# EAGLE design RPi_Extension_contr_sens_conn_board (EAGLE 8.1.1)
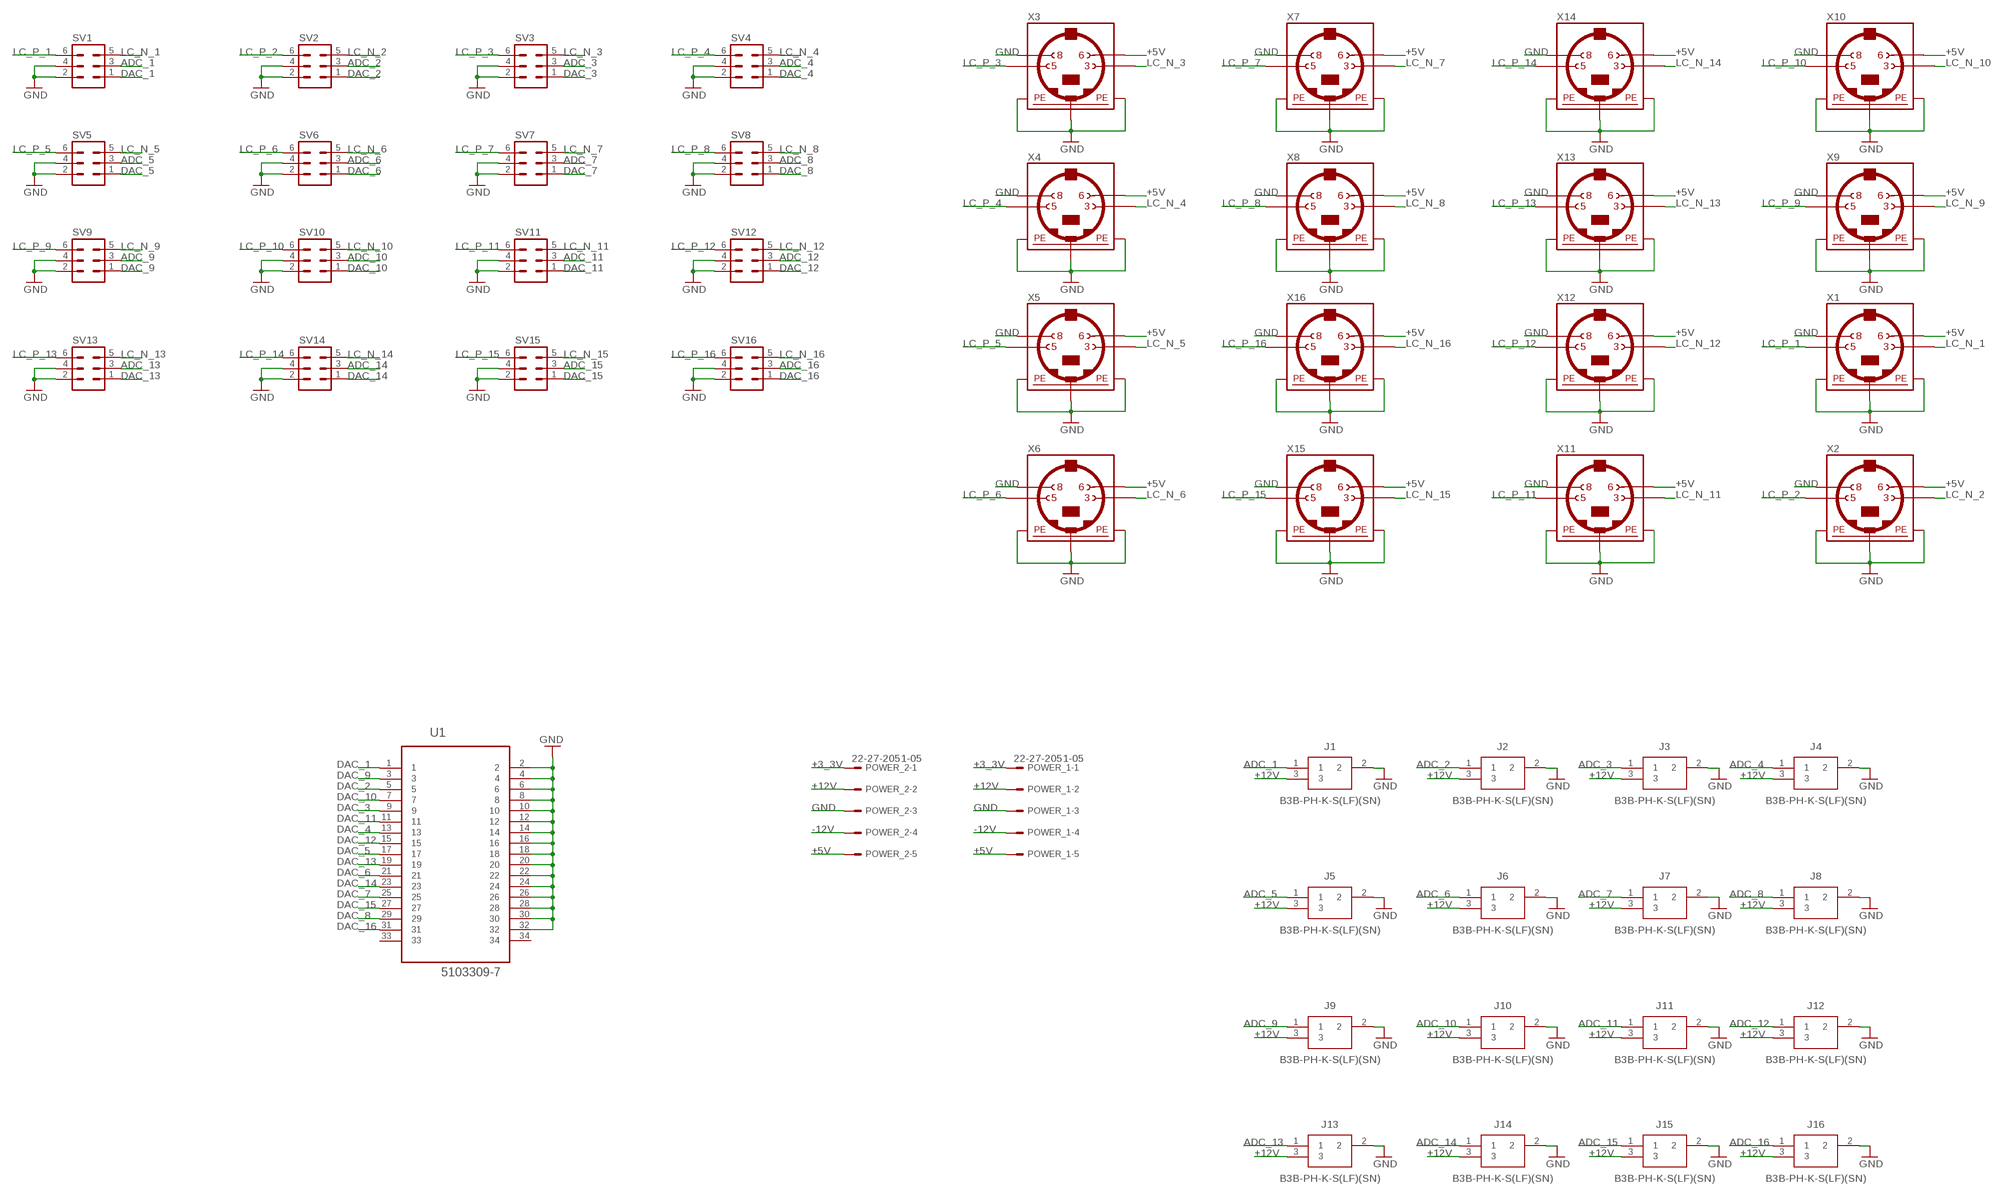
[diagram p0: schematic, sheet 1]

## Parts
J1  B3B-PH-K-S(LF)(SN)  [SHDR3W50P0X200_1X3_790X450X600]
J2  B3B-PH-K-S(LF)(SN)  [SHDR3W50P0X200_1X3_790X450X600]
J3  B3B-PH-K-S(LF)(SN)  [SHDR3W50P0X200_1X3_790X450X600]
J4  B3B-PH-K-S(LF)(SN)  [SHDR3W50P0X200_1X3_790X450X600]
J5  B3B-PH-K-S(LF)(SN)  [SHDR3W50P0X200_1X3_790X450X600]
J6  B3B-PH-K-S(LF)(SN)  [SHDR3W50P0X200_1X3_790X450X600]
J7  B3B-PH-K-S(LF)(SN)  [SHDR3W50P0X200_1X3_790X450X600]
J8  B3B-PH-K-S(LF)(SN)  [SHDR3W50P0X200_1X3_790X450X600]
J9  B3B-PH-K-S(LF)(SN)  [SHDR3W50P0X200_1X3_790X450X600]
J10  B3B-PH-K-S(LF)(SN)  [SHDR3W50P0X200_1X3_790X450X600]
J11  B3B-PH-K-S(LF)(SN)  [SHDR3W50P0X200_1X3_790X450X600]
J12  B3B-PH-K-S(LF)(SN)  [SHDR3W50P0X200_1X3_790X450X600]
J13  B3B-PH-K-S(LF)(SN)  [SHDR3W50P0X200_1X3_790X450X600]
J14  B3B-PH-K-S(LF)(SN)  [SHDR3W50P0X200_1X3_790X450X600]
J15  B3B-PH-K-S(LF)(SN)  [SHDR3W50P0X200_1X3_790X450X600]
J16  B3B-PH-K-S(LF)(SN)  [SHDR3W50P0X200_1X3_790X450X600]
POWER_1  22-27-2051-05  [6410-05]
POWER_2  22-27-2051-05  [6410-05]
SV1  MA03-2  [MA03-2]
SV2  MA03-2  [MA03-2]
SV3  MA03-2  [MA03-2]
SV4  MA03-2  [MA03-2]
SV5  MA03-2  [MA03-2]
SV6  MA03-2  [MA03-2]
SV7  MA03-2  [MA03-2]
SV8  MA03-2  [MA03-2]
SV9  MA03-2  [MA03-2]
SV10  MA03-2  [MA03-2]
SV11  MA03-2  [MA03-2]
SV12  MA03-2  [MA03-2]
SV13  MA03-2  [MA03-2]
SV14  MA03-2  [MA03-2]
SV15  MA03-2  [MA03-2]
SV16  MA03-2  [MA03-2]
U1  5103309-7  [TYCO_5103309-7]
X1  MINI_DIN_4  [M_DIN4]
X2  MINI_DIN_4  [M_DIN4]
X3  MINI_DIN_4  [M_DIN4]
X4  MINI_DIN_4  [M_DIN4]
X5  MINI_DIN_4  [M_DIN4]
X6  MINI_DIN_4  [M_DIN4]
X7  MINI_DIN_4  [M_DIN4]
X8  MINI_DIN_4  [M_DIN4]
X9  MINI_DIN_4  [M_DIN4]
X10  MINI_DIN_4  [M_DIN4]
X11  MINI_DIN_4  [M_DIN4]
X12  MINI_DIN_4  [M_DIN4]
X13  MINI_DIN_4  [M_DIN4]
X14  MINI_DIN_4  [M_DIN4]
X15  MINI_DIN_4  [M_DIN4]
X16  MINI_DIN_4  [M_DIN4]

## Nets
+3_3V: POWER_1.1 POWER_2.1
+5V: POWER_1.5 POWER_2.5 X1.6 X2.6 X3.6 X4.6 X5.6 X6.6 X7.6 X8.6 X9.6 X10.6 X11.6 X12.6 X13.6 X14.6 X15.6 X16.6
+12V: J1.3 J2.3 J3.3 J4.3 J5.3 J6.3 J7.3 J8.3 J9.3 J10.3 J11.3 J12.3 J13.3 J14.3 J15.3 J16.3 POWER_1.2 POWER_2.2
-12V: POWER_1.4 POWER_2.4
ADC_1: J1.1 SV1.3
ADC_2: J2.1 SV2.3
ADC_3: J3.1 SV3.3
ADC_4: J4.1 SV4.3
ADC_5: J5.1 SV5.3
ADC_6: J6.1 SV6.3
ADC_7: J7.1 SV7.3
ADC_8: J8.1 SV8.3
ADC_9: J9.1 SV9.3
ADC_10: J10.1 SV10.3
ADC_11: J11.1 SV11.3
ADC_12: J12.1 SV12.3
ADC_13: J13.1 SV13.3
ADC_14: J14.1 SV14.3
ADC_15: J15.1 SV15.3
ADC_16: J16.1 SV16.3
DAC_1: SV1.1 U1.1
DAC_2: SV2.1 U1.5
DAC_3: SV3.1 U1.9
DAC_4: SV4.1 U1.13
DAC_5: SV5.1 U1.17
DAC_6: SV6.1 U1.21
DAC_7: SV7.1 U1.25
DAC_8: SV8.1 U1.29
DAC_9: SV9.1 U1.3
DAC_10: SV10.1 U1.7
DAC_11: SV11.1 U1.11
DAC_12: SV12.1 U1.15
DAC_13: SV13.1 U1.19
DAC_14: SV14.1 U1.23
DAC_15: SV15.1 U1.27
DAC_16: SV16.1 U1.31
GND: J1.2 J2.2 J3.2 J4.2 J5.2 J6.2 J7.2 J8.2 J9.2 J10.2 J11.2 J12.2 J13.2 J14.2 J15.2 J16.2 POWER_1.3 POWER_2.3 SV1.2 SV1.4 SV2.2 SV2.4 SV3.2 SV3.4 SV4.2 SV4.4 SV5.2 SV5.4 SV6.2 SV6.4 SV7.2 SV7.4 SV8.2 SV8.4 SV9.2 SV9.4 SV10.2 SV10.4 SV11.2 SV11.4 SV12.2 SV12.4 SV13.2 SV13.4 SV14.2 SV14.4 SV15.2 SV15.4 SV16.2 SV16.4 U1.2 U1.4 U1.6 U1.8 U1.10 U1.12 U1.14 U1.16 U1.18 U1.20 U1.22 U1.24 U1.26 U1.28 U1.30 U1.32 X1.8 X1.SH1(PE1) X1.SH2(PE2) X1.SH3(PE3) X2.8 X2.SH1(PE1) X2.SH2(PE2) X2.SH3(PE3) X3.8 X3.SH1(PE1) X3.SH2(PE2) X3.SH3(PE3) X4.8 X4.SH1(PE1) X4.SH2(PE2) X4.SH3(PE3) X5.8 X5.SH1(PE1) X5.SH2(PE2) X5.SH3(PE3) X6.8 X6.SH1(PE1) X6.SH2(PE2) X6.SH3(PE3) X7.8 X7.SH1(PE1) X7.SH2(PE2) X7.SH3(PE3) X8.8 X8.SH1(PE1) X8.SH2(PE2) X8.SH3(PE3) X9.8 X9.SH1(PE1) X9.SH2(PE2) X9.SH3(PE3) X10.8 X10.SH1(PE1) X10.SH2(PE2) X10.SH3(PE3) X11.8 X11.SH1(PE1) X11.SH2(PE2) X11.SH3(PE3) X12.8 X12.SH1(PE1) X12.SH2(PE2) X12.SH3(PE3) X13.8 X13.SH1(PE1) X13.SH2(PE2) X13.SH3(PE3) X14.8 X14.SH1(PE1) X14.SH2(PE2) X14.SH3(PE3) X15.8 X15.SH1(PE1) X15.SH2(PE2) X15.SH3(PE3) X16.8 X16.SH1(PE1) X16.SH2(PE2) X16.SH3(PE3)
LC_N_1: SV1.5 X1.3
LC_N_2: SV2.5 X2.3
LC_N_3: SV3.5 X3.3
LC_N_4: SV4.5 X4.3
LC_N_5: SV5.5 X5.3
LC_N_6: SV6.5 X6.3
LC_N_7: SV7.5 X7.3
LC_N_8: SV8.5 X8.3
LC_N_9: SV9.5 X9.3
LC_N_10: SV10.5 X10.3
LC_N_11: SV11.5 X11.3
LC_N_12: SV12.5 X12.3
LC_N_13: SV13.5 X13.3
LC_N_14: SV14.5 X14.3
LC_N_15: SV15.5 X15.3
LC_N_16: SV16.5 X16.3
LC_P_1: SV1.6 X1.5
LC_P_2: SV2.6 X2.5
LC_P_3: SV3.6 X3.5
LC_P_4: SV4.6 X4.5
LC_P_5: SV5.6 X5.5
LC_P_6: SV6.6 X6.5
LC_P_7: SV7.6 X7.5
LC_P_8: SV8.6 X8.5
LC_P_9: SV9.6 X9.5
LC_P_10: SV10.6 X10.5
LC_P_11: SV11.6 X11.5
LC_P_12: SV12.6 X12.5
LC_P_13: SV13.6 X13.5
LC_P_14: SV14.6 X14.5
LC_P_15: SV15.6 X15.5
LC_P_16: SV16.6 X16.5
Unconnected: U1.33 U1.34

## Library data of the parts
J1-J16 = JST_PH:B3B-PH-K-S(LF)(SN): PH-2.0mm Header top entry 3 way JST PH Series, Series Number B3B, 2mm Pitch 3 Way 1 Row Straight PCB Header, Through Hole Termination, 2A <https://componentsearchengine.com/Images/3/B3B-PH-K-S%28LF%29%28SN%29.jpg> Source: Datasheet <http://uk.rs-online.com/web/p/products/8201431>; DESCRIPTION: PH-2.0mm Header top entry 3 way JST PH Series, Series Number B3B, 2mm Pitch 3 Way 1 Row Straight PCB Header, Through Hole Termination, 2A; HEIGHT: 6mm; MANUFACTURER_NAME: JST (JAPAN SOLDERLESS TERMINALS); MANUFACTURER_PART_NUMBER: B3B-PH-K-S(LF)(SN); RS_PART_NUMBER: 8201431P; SUPPLIER_NAME: RS
POWER_1 POWER_2 = con-molex:22-?-05: CONNECTOR wire to board 2.54 mm (.1 inch) pitch header; OC_FARNELL: unknown; OC_NEWARK: unknown
SV1-SV16 = con-lstb:MA03-2: PIN HEADER; OC_FARNELL: unknown; OC_NEWARK: unknown
U1 = AMP 5103309-7 34pin:5103309-7: WIRE-BOARD CONN, HEADER, 34POS; MPN: 5103309-7; OC_FARNELL: 1425170; OC_NEWARK: 02M6713; PACKAGE: 34 WAY HEADER; SUPPLIER: TycoElectronics
X1-X16 = mini_din:MINI_DIN_4

## Board
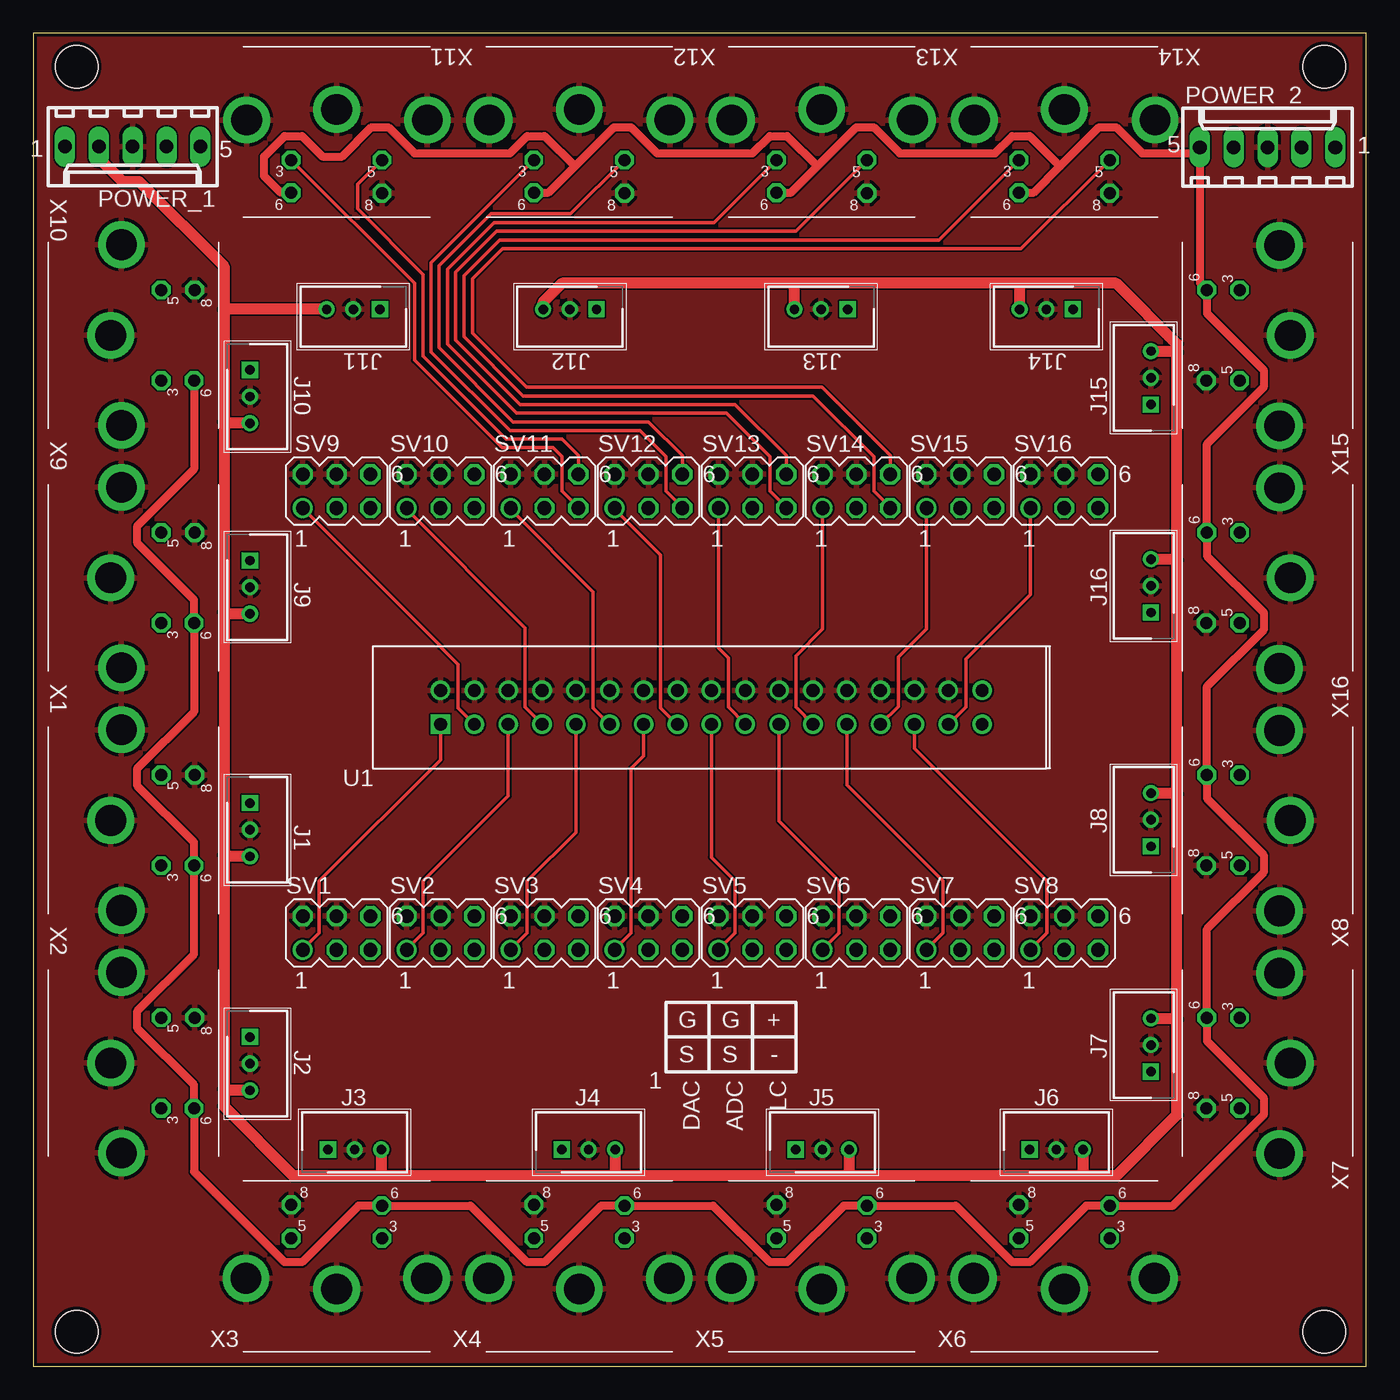
[diagram p1: board, top side]
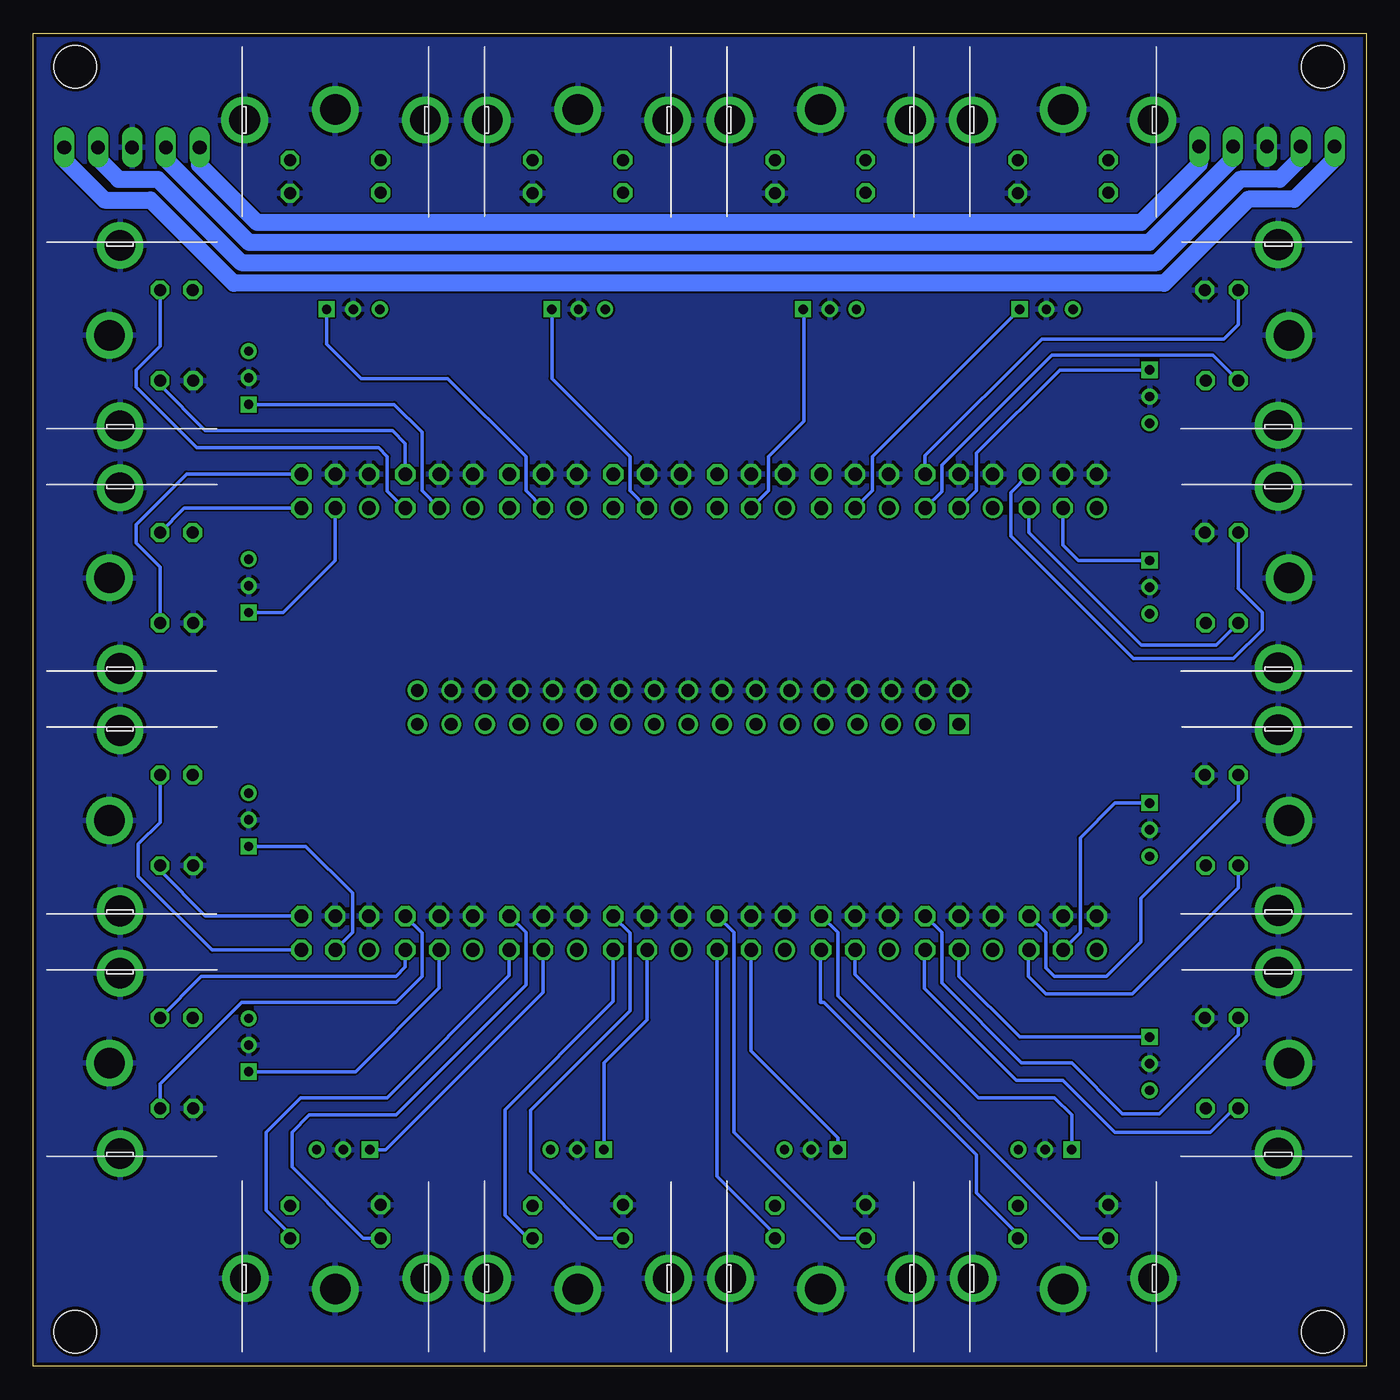
[diagram p2: board, bottom side, seen from below]

Size 100 x 100 mm. Coordinates in mm from the lower left corner, seen from the top.
Outline: 0,0 100,0 100,100 0,100 0,0
Copper layers (1*16): Top 0.035mm / dielectric 1.5mm / Bottom 0.035mm
Design rules "dirt_cheap_dirty_boards.v1": minimum track width 5mil, minimum drill 12mil, track to track 5mil, track to pad 5mil, pad to pad 5mil, via to via 5mil, smd to smd 0mil, copper to edge 10mil, drill to drill 10mil, minimum pad ring 10mil, minimum via ring 6mil, stop-mask expansion 2mil, vias tented up to drill 25mil, thermal gap 10mil
Holes 3.2 mm at 3.25,97.5 96.85,97.5 3.25,2.6 96.85,2.6

### Footprints (pad centres in the part's own frame; a part is rotated, then mirrored left to right if it is on the bottom)
SHDR3W50P0X200_1X3_790X450X600 = drill 0.7 pad 1.1 square: 1 0,0 | drill 0.7 pad 1.1: 2 2,0; 3 4,0
6410-05 = drill 1.016 long: 1 5.08,0; 2 2.54,0; 3 0,0; 4 -2.54,0; 5 -5.08,0
MA03-2 = drill 1.016: 1 -2.54,-1.27 | drill 1.016 octagon: 2 -2.54,1.27; 3 0,-1.27; 4 0,1.27; 5 2.54,-1.27; 6 2.54,1.27
TYCO_5103309-7 = drill 0.965 square: 1 0,2.54 | drill 0.965: 2 0,0; 3 -2.54,2.54; 4 -2.54,0; 5 -5.08,2.54; 6 -5.08,0; 7 -7.62,2.54; 8 -7.62,0; 9 -10.16,2.54; 10 -10.16,0; 11 -12.7,2.54; 12 -12.7,0; 13 -15.24,2.54; 14 -15.24,0; 15 -17.78,2.54; 16 -17.78,0; 17 -20.32,2.54; 18 -20.32,0; 19 -22.86,2.54; 20 -22.86,0; 21 -25.4,2.54; 22 -25.4,0; 23 -27.94,2.54; 24 -27.94,0; 25 -30.48,2.54; 26 -30.48,0; 27 -33.02,2.54; 28 -33.02,0; 29 -35.56,2.54; 30 -35.56,0; 31 -38.1,2.54; 32 -38.1,0; 33 -40.64,2.54; 34 -40.64,0
M_DIN4 = drill 0.9 pad 1.422 octagon: 3 -3.4,-3.75; 5 3.4,-3.75; 6 -3.4,-6.2; 8 3.4,-6.25 | drill 2.3 pad 3.5: SH1 6.8,-0.75; SH2 0,0.05; SH3 -6.75,-0.75

### Placement (x,y rotation side)
J1  16.25,42.25 270 top
J2  16.25,24.7 270 top
J3  22.1,16.25 0 top
J4  39.65,16.25 0 top
J5  57.2,16.25 0 top
J6  74.75,16.25 0 top
J7  83.85,22.1 90 top
J8  83.85,39 90 top
J9  16.25,60.45 270 top
J10  16.25,74.75 270 top
J11  26,79.3 180 top
J12  42.25,79.3 180 top
J13  61.1,79.3 180 top
J14  78,79.3 180 top
J15  83.85,72.15 90 top
J16  83.85,56.55 90 top
POWER_1  7.45,91.5 180 top
POWER_2  92.6,91.45 0 top
SV1  22.75,32.5 0 top
SV2  30.55,32.5 0 top
SV3  38.35,32.5 0 top
SV4  46.15,32.5 0 top
SV5  53.95,32.5 0 top
SV6  61.75,32.5 0 top
SV7  69.55,32.5 0 top
SV8  77.35,32.5 0 top
SV9  22.75,65.65 0 top
SV10  30.55,65.65 0 top
SV11  38.35,65.65 0 top
SV12  46.15,65.65 0 top
SV13  53.95,65.65 0 top
SV14  61.75,65.65 0 top
SV15  69.55,65.65 0 top
SV16  77.35,65.65 0 top
U1  30.55,50.7 180 top
X1  5.85,40.95 90 top
X2  5.85,22.75 90 top
X3  22.75,5.85 180 top
X4  40.95,5.85 180 top
X5  59.15,5.85 180 top
X6  77.35,5.85 180 top
X7  94.25,22.75 270 top
X8  94.25,40.95 270 top
X9  5.85,59.15 90 top
X10  5.85,77.35 90 top
X11  22.75,94.25 0 top
X12  40.95,94.25 0 top
X13  59.15,94.25 0 top
X14  77.35,94.25 0 top
X15  94.25,77.35 270 top
X16  94.25,59.15 270 top

### Tracks (layer width: path | path; a pad name or v marks a point on that pad's centre or on a via)
+3_3V
  Bottom 1.27: POWER_1.1 2.37,90.58 5.4,87.55 8.85,87.55 15.15,81.25 84.95,81.25 91.2,87.5 94.65,87.5 97.68,90.53 POWER_2.1
+5V
  Top 0.61: X10.6 12.05,67.3 7.8,63.05 7.8,61.75 12.05,57.5 X9.6 12.05,49.1 7.8,44.85 7.8,43.55 12.05,39.3 X1.6 12.05,30.9 7.8,26.65 7.8,25.35 12.05,21.1 X2.6 12.05,14.6 18.85,7.8 20.15,7.8 24.4,12.05 X3.6 32.8,12.05 37.05,7.8 38.35,7.8 42.6,12.05 X4.6 51,12.05 55.25,7.8 56.55,7.8 60.8,12.05 X5.6 69.2,12.05 73.45,7.8 74.75,7.8 79,12.05 X6.6 85.5,12.05 92.3,18.85 92.3,20.15 88.05,24.4 X7.6 88.05,32.8 92.3,37.05 92.3,38.35 88.05,42.6 X8.6 88.05,51 92.3,55.25 92.3,56.55 88.05,60.8 X16.6 88.05,69.2 92.3,73.45 92.3,74.75 88.05,79 X15.6 87.52,81.28 POWER_2.5 87.07,91 83.2,91 81.25,92.95 79.95,92.95 77.03,90.03 | X14.6 75.05,88.05 77.03,90.03 | X13.6 56.85,88.05 58.83,90.03 | 58.83,90.03 61.75,92.95 63.05,92.95 65,91 72.15,91 73.45,92.3 74.75,92.3 77.03,90.03 | X12.6 38.65,88.05 40.62,90.03 | 40.62,90.03 43.55,92.95 44.85,92.95 46.8,91 53.95,91 55.25,92.3 56.55,92.3 58.83,90.03 | 40.62,90.03 38.35,92.3 37.05,92.3 35.75,91 28.6,91 26.65,92.95 25.35,92.95 23.15,90.75 21.7,90.75 20.15,92.3 18.85,92.3 17.3,90.75 17.3,89.3 18.55,88.05 X11.6
  Bottom 1.27: POWER_1.5 12.53,90.17 16.9,85.8 83.2,85.8 87.52,90.12 POWER_2.5
+12V
  Top 0.813: POWER_1.2 4.91,90.64 6.65,88.9 7.92,88.9 14.3,82.52 14.3,79.3 | 14.3,79.3 14.3,70.85 | 14.3,70.85 14.3,56.55 | 14.3,56.55 14.3,38.35 | 14.3,38.35 14.3,20.8 | 14.3,20.8 14.3,19.5 19.5,14.3 26,14.3 | 78.65,14.3 81.25,14.3 85.8,18.85 85.8,26 | 78.65,14.3 61.1,14.3 | 61.1,14.3 43.55,14.3 | 43.55,14.3 26,14.3 | 85.8,26 85.8,42.9 | 85.8,42.9 85.8,60.45 | 85.8,60.45 85.8,76.05 | 85.8,76.05 85.8,76.7 81.25,81.25 74.1,81.25 | 74.1,81.25 57.2,81.25 | 57.2,81.25 39.65,81.25 38.25,79.85 J12.3 | J10.3 14.4,70.75 14.3,70.85 | J9.3 14.4,56.45 14.3,56.55 | J1.3 14.4,38.25 14.3,38.35 | J2.3 14.4,20.7 14.3,20.8 | J3.3 26.1,14.4 26,14.3 | J4.3 43.65,14.4 43.55,14.3 | J5.3 61.2,14.4 61.1,14.3 | J6.3 78.75,14.4 78.65,14.3 | J7.3 85.7,26.1 85.8,26 | J8.3 85.7,43 85.8,42.9 | J16.3 85.7,60.55 85.8,60.45 | J15.3 85.7,76.15 85.8,76.05 | J14.3 74,81.15 74.1,81.25 | J13.3 57.1,81.15 57.2,81.25 | J11.3 14.3,79.3
  Bottom 1.27: POWER_1.2 4.91,90.64 6.5,89.05 9.45,89.05 15.7,82.8 84.4,82.8 90.65,89.05 93.6,89.05 95.14,90.59 POWER_2.2
-12V
  Top 0.813: 9.99,90.61 POWER_1.4
  Bottom 1.27: POWER_2.4 90.06,90.56 83.8,84.3 16.3,84.3 9.99,90.61 POWER_1.4
ADC_1
  Bottom 0.254: SV1.3 21.45,32.53 21.45,39.65 18.85,42.25 J1.1
ADC_2
  Bottom 0.254: SV2.3 30.55,29.25 26,24.7 J2.1
ADC_3
  Bottom 0.254: SV3.3 38.35,29.39 29.11,20.15 23.4,20.15 22.1,18.85 J3.1
ADC_4
  Bottom 0.254: SV4.3 46.15,23.65 39.65,17.15 J4.1
ADC_5
  Bottom 0.254: SV5.3 53.95,26 57.2,22.75 J5.1
ADC_6
  Bottom 0.254: SV6.3 61.75,28.06 73.56,16.25 J6.1
ADC_7
  Bottom 0.254: SV7.3 69.55,28.38 75.83,22.1 J7.1
ADC_8
  Bottom 0.254: SV8.3 76.05,32.53 76.05,35.5 79.55,39 J8.1
ADC_9
  Bottom 0.254: SV9.3 22.75,61.62 21.58,60.45 J9.1
ADC_10
  Bottom 0.254: SV10.3 29.25,65.68 29.25,68.5 23,74.75 J10.1
ADC_11
  Bottom 0.254: J11.1 37.05,68.25 37.05,65.68 SV11.3
ADC_12
  Bottom 0.254: SV12.3 44.85,65.68 44.85,68.25 42.2,70.9 42.2,79.25 J12.1
ADC_13
  Bottom 0.254: SV13.3 55.25,65.68 55.25,68.25 61.1,74.1 J13.1
ADC_14
  Bottom 0.254: SV14.3 63.05,65.68 63.05,68.25 68.9,74.1 75.4,74.1 78,76.7 J14.1
ADC_15
  Bottom 0.254: SV15.3 70.85,65.68 70.85,70.07 72.93,72.15 J15.1
ADC_16
  Bottom 0.254: SV16.3 77.35,60.45 81.25,56.55 J16.1
DAC_1
  Top 0.254: SV1.1 20.21,31.26 21.45,32.5 21.45,36.4 30.55,45.5 U1.1
DAC_2
  Top 0.254: SV2.1 28.01,31.26 29.25,32.5 29.25,36.4 35.63,42.78 U1.5
DAC_3
  Top 0.254: SV3.1 35.81,31.26 37.05,32.5 37.05,36.4 40.71,40.06 U1.9
DAC_4
  Top 0.254: SV4.1 43.61,31.26 44.85,32.5 44.85,44.85 45.79,45.79 U1.13
DAC_5
  Top 0.254: SV5.1 51.41,31.26 52.65,32.5 52.65,36.4 50.87,38.18 U1.17
DAC_6
  Top 0.254: SV6.1 59.21,31.26 60.45,32.5 60.45,34.45 60.45,34.85 60.45,36.4 55.95,40.9 U1.21
DAC_7
  Top 0.254: SV7.1 67.01,31.26 68.25,32.5 68.25,36.4 61.03,43.62 U1.25
DAC_8
  Top 0.254: SV8.1 74.81,31.26 76.05,32.5 76.05,36.4 66.11,46.34 U1.29
DAC_9
  Top 0.254: U1.3 31.85,49.4 31.85,52.65 30.55,53.95 30.55,54.04 SV9.1
DAC_10
  Top 0.254: SV10.1 28.01,64.29 36.9,55.4 36.9,49.45 38.17,48.18 U1.7
DAC_11
  Top 0.254: SV11.1 35.81,64.29 42,58.1 42,49.4 U1.11
DAC_12
  Top 0.254: SV12.1 43.61,64.29 47.05,60.85 47.05,49.4 48.29,48.16 U1.15
DAC_13
  Top 0.254: SV13.1 51.41,53.89 52.15,53.15 52.15,49.45 53.41,48.19 U1.19
DAC_14
  Top 0.254: SV14.1 59.21,55.31 57.2,53.3 57.2,49.45 U1.23
DAC_15
  Top 0.254: SV15.1 67.01,55.31 64.9,53.2 64.9,49.5 U1.27
DAC_16
  Top 0.254: SV16.1 74.81,57.91 69.95,53.05 69.95,49.45 U1.31
GND
  pour Top: -0.65,-0.65 100.65,-0.65 100.65,100.65 -0.65,100.65
  pour Bottom: -0.5,-0.5 -0.5,100.5 100.5,100.5 100.5,-0.5
LC_N_1
  Bottom 0.254: SV1.5 25.35,31.17 25.35,29.25 24.05,27.95 17.55,27.95 9.6,35.9 X1.3
LC_N_2
  Bottom 0.254: X2.3 9.9,19.35 11.7,17.55 18.85,17.55 22.75,21.45 26.24,21.45 33.15,28.36 33.15,31.17 SV2.5
LC_N_3
  Bottom 0.254: X3.3 26.15,9.9 29.25,13 29.25,15.85 40.7,27.3 40.95,27.3 40.95,31.17 SV3.5
LC_N_4
  Bottom 0.254: X4.3 44.35,9.9 48.69,14.24 SV4.5
LC_N_5
  Bottom 0.254: X5.3 62.9,9.6 64.61,11.31 64.61,19.24 56.49,27.36 SV5.5
LC_N_6
  Bottom 0.254: X6.3 80.75,9.9 82.55,11.7 82.55,17.55 79.95,20.15 73.45,20.15 64.29,29.31 SV6.5
LC_N_7
  Bottom 0.254: X7.3 87.4,29.25 72.8,29.25 72.09,29.96 SV7.5
LC_N_8
  Bottom 0.254: X8.3 90.5,40.8 92.11,39.19 92.11,36.75 86.6,31.23 SV8.5
LC_N_9
  Bottom 0.254: X9.3 11.24,54.11 16.86,54.11 25.29,62.54 SV9.5
LC_N_10
  Bottom 0.254: X10.3 11.51,75.86 23.59,75.86 31.85,67.6 31.85,65.62 SV10.5
LC_N_11
  Top 0.254: SV11.5 40.89,64.41 39.65,65.65 39.65,68.25 39,68.9 35.18,68.9 28.6,75.48 28.6,81.25 X11.3
LC_N_12
  Top 0.254: SV12.5 48.69,64.41 47.45,65.65 47.45,68.25 45.5,70.2 35.76,70.2 29.86,76.1 29.86,82.81 36.75,89.7 X12.3
LC_N_13
  Top 0.254: SV13.5 56.49,64.41 55.25,65.65 55.25,68.25 52,71.5 36.24,71.5 31.07,76.67 31.07,82.32 34.55,85.8 51.05,85.8 X13.3 54.95,89.7
LC_N_14
  Top 0.254: SV14.5 64.29,64.41 63.05,65.65 63.05,68.25 58.5,72.8 36.76,72.8 32.32,77.24 32.32,81.83 34.99,84.5 67.95,84.5 X14.3
LC_N_15
  Bottom 0.254: X15.3 90.5,76.55 92.3,74.75 92.3,73.45 87.75,68.9 74.1,68.9 73.45,68.25 73.45,65.65 72.18,64.38 SV15.5
LC_N_16
  Bottom 0.254: SV16.5 88.67,64.38 X16.3
LC_P_1
  Bottom 0.254: X1.5 9.6,42.4 16.9,35.1 16.9,31.85 19.5,29.25 23.4,29.25 24.05,29.9 24.05,32.53 SV1.6
LC_P_2
  Bottom 0.254: X2.5 9.6,24.85 15.52,18.93 18.28,18.93 22.1,22.75 25.86,22.75 31.85,28.74 31.85,32.53 SV2.6
LC_P_3
  Bottom 0.254: X3.5 21.48,9.6 39.65,27.77 39.65,32.53 SV3.6
LC_P_4
  Bottom 0.254: X4.5 39.5,9.6 47.45,17.55 47.45,32.53 SV4.6
LC_P_5
  Bottom 0.254: X5.5 57.7,9.6 62.7,14.6 62.7,19.2 55.25,26.65 55.25,32.5 56.49,33.74 SV5.6
LC_P_6
  Bottom 0.254: X6.5 75.25,9.6 80.6,14.95 80.6,17.55 79.3,18.85 72.8,18.85 63.05,28.6 63.05,32.53 SV6.6
LC_P_7
  Bottom 0.254: SV7.6 72.09,33.74 70.85,32.5 70.85,29.25 72.8,27.3 84.38,27.3 90.5,21.18 X7.5
LC_P_8
  Bottom 0.254: X8.5 90.5,37.2 87.1,33.8 79.92,33.8 SV8.6
LC_P_9
  Bottom 0.254: SV9.6 26.65,65.56 26.65,62.27 17.47,53.09 9.96,53.09 7.8,55.25 7.8,56.55 9.6,58.35 X9.5
LC_P_10
  Bottom 0.254: X10.5 9.6,78.15 10.7,77.05 24.35,77.05 33.09,68.31 SV10.6
LC_P_11
  Top 0.254: X11.5 24.32,88.67 24.32,86.83 29.25,81.9 29.25,75.78 35.48,69.55 39.65,69.55 40.89,68.31 SV11.6
LC_P_12
  Top 0.254: SV12.6 48.69,68.31 46.15,70.85 36.01,70.85 30.46,76.4 30.46,82.56 34.35,86.45 40.3,86.45 X12.5
LC_P_13
  Top 0.254: X13.5 57.2,85.15 34.77,85.15 31.69,82.07 31.69,76.97 36.51,72.15 52.65,72.15 56.49,68.31 SV13.6
LC_P_14
  Top 0.254: X14.5 74.1,83.85 35.22,83.85 32.95,81.58 32.95,77.5 37,73.45 59.15,73.45 64.29,68.31 SV14.6
LC_P_15
  Bottom 0.254: SV15.6 72.09,69.24 73.05,70.2 87.1,70.2 90.5,73.6 X15.5
LC_P_16
  Bottom 0.254: X16.5 90.5,59.95 92.3,61.75 92.3,63.16 88.51,66.95 79.92,66.95 SV16.6

### Text on the board
tNames: G | G | + | S | S | - | 1 | DAC | ADC | LC